# Altium schematic sheet NIXIE_1.SchDoc
size A4; SheetNumber: 4; SheetTotal: 6
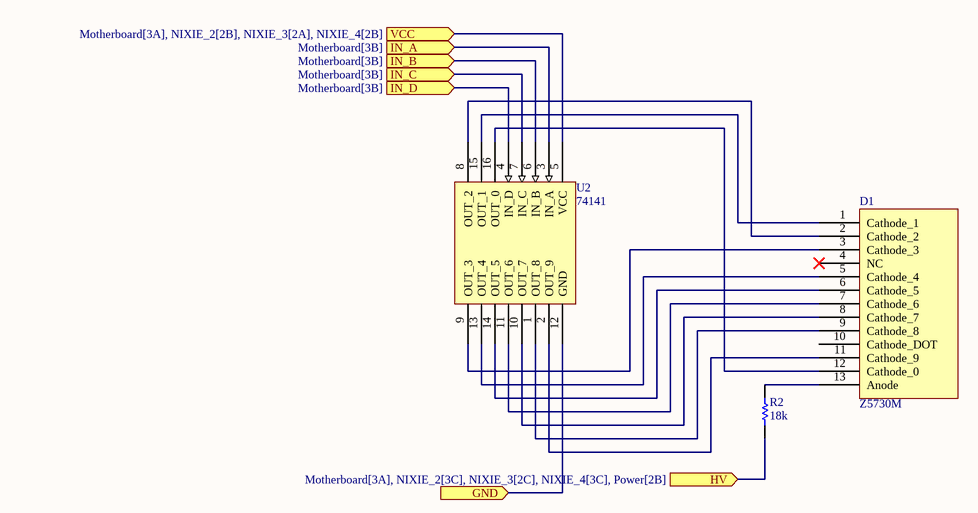
[diagram p0: NIXIE_1.SchDoc]

## Parts
D1  Z5730M  [Z5730M]
R2  18k  [RESC2013X60X40LL20T25]
U2  74141  [DIP-16]

## Ports
GND (in, see Motherboard[3B], NIXIE_2[2C], NIXIE_3[2C], NIXIE_4[2C], Power[3B], STM32[1B]), HV (in, see Motherboard[3A], NIXIE_2[3C], NIXIE_3[2C], NIXIE_4[3C], Power[2B]), IN_A (in, see Motherboard[3B]), IN_B (in, see Motherboard[3B]), IN_C (in, see Motherboard[3B]), IN_D (in, see Motherboard[3B]), VCC (in, see Motherboard[3A], NIXIE_2[2B], NIXIE_3[2A], NIXIE_4[2B])

## Nets
GND: U2.12(GND) ; port GND
HV: R2.1 ; port HV
IN_A: U2.3(IN_A) ; port IN_A
IN_B: U2.6(IN_B) ; port IN_B
IN_C: U2.7(IN_C) ; port IN_C
IN_D: U2.4(IN_D) ; port IN_D
VCC: U2.5(VCC) ; port VCC
NetD1_1: D1.1(Cathode_1) U2.15(OUT_1)
NetD1_2: D1.2(Cathode_2) U2.8(OUT_2)
NetD1_3: D1.3(Cathode_3) U2.9(OUT_3)
NetD1_5: D1.5(Cathode_4) U2.13(OUT_4)
NetD1_6: D1.6(Cathode_5) U2.14(OUT_5)
NetD1_7: D1.7(Cathode_6) U2.11(OUT_6)
NetD1_8: D1.8(Cathode_7) U2.10(OUT_7)
NetD1_9: D1.9(Cathode_8) U2.1(OUT_8)
NetD1_11: D1.11(Cathode_9) U2.2(OUT_9)
NetD1_12: D1.12(Cathode_0) U2.16(OUT_0)
NetD1_13: D1.13(Anode) R2.2

Not connected (* = marked no-connect by the designer): D1 4(NC)* 10(Cathode_DOT)

## Library data of the parts
R2 = CMP-2001-00606-1: Manufacturer: Panasonic; Part Number: ERA6AEB183V